# Altium schematic sheet MULTIPLIER.SchDoc
size Tabloid; SheetNumber: 7; SheetTotal: 9
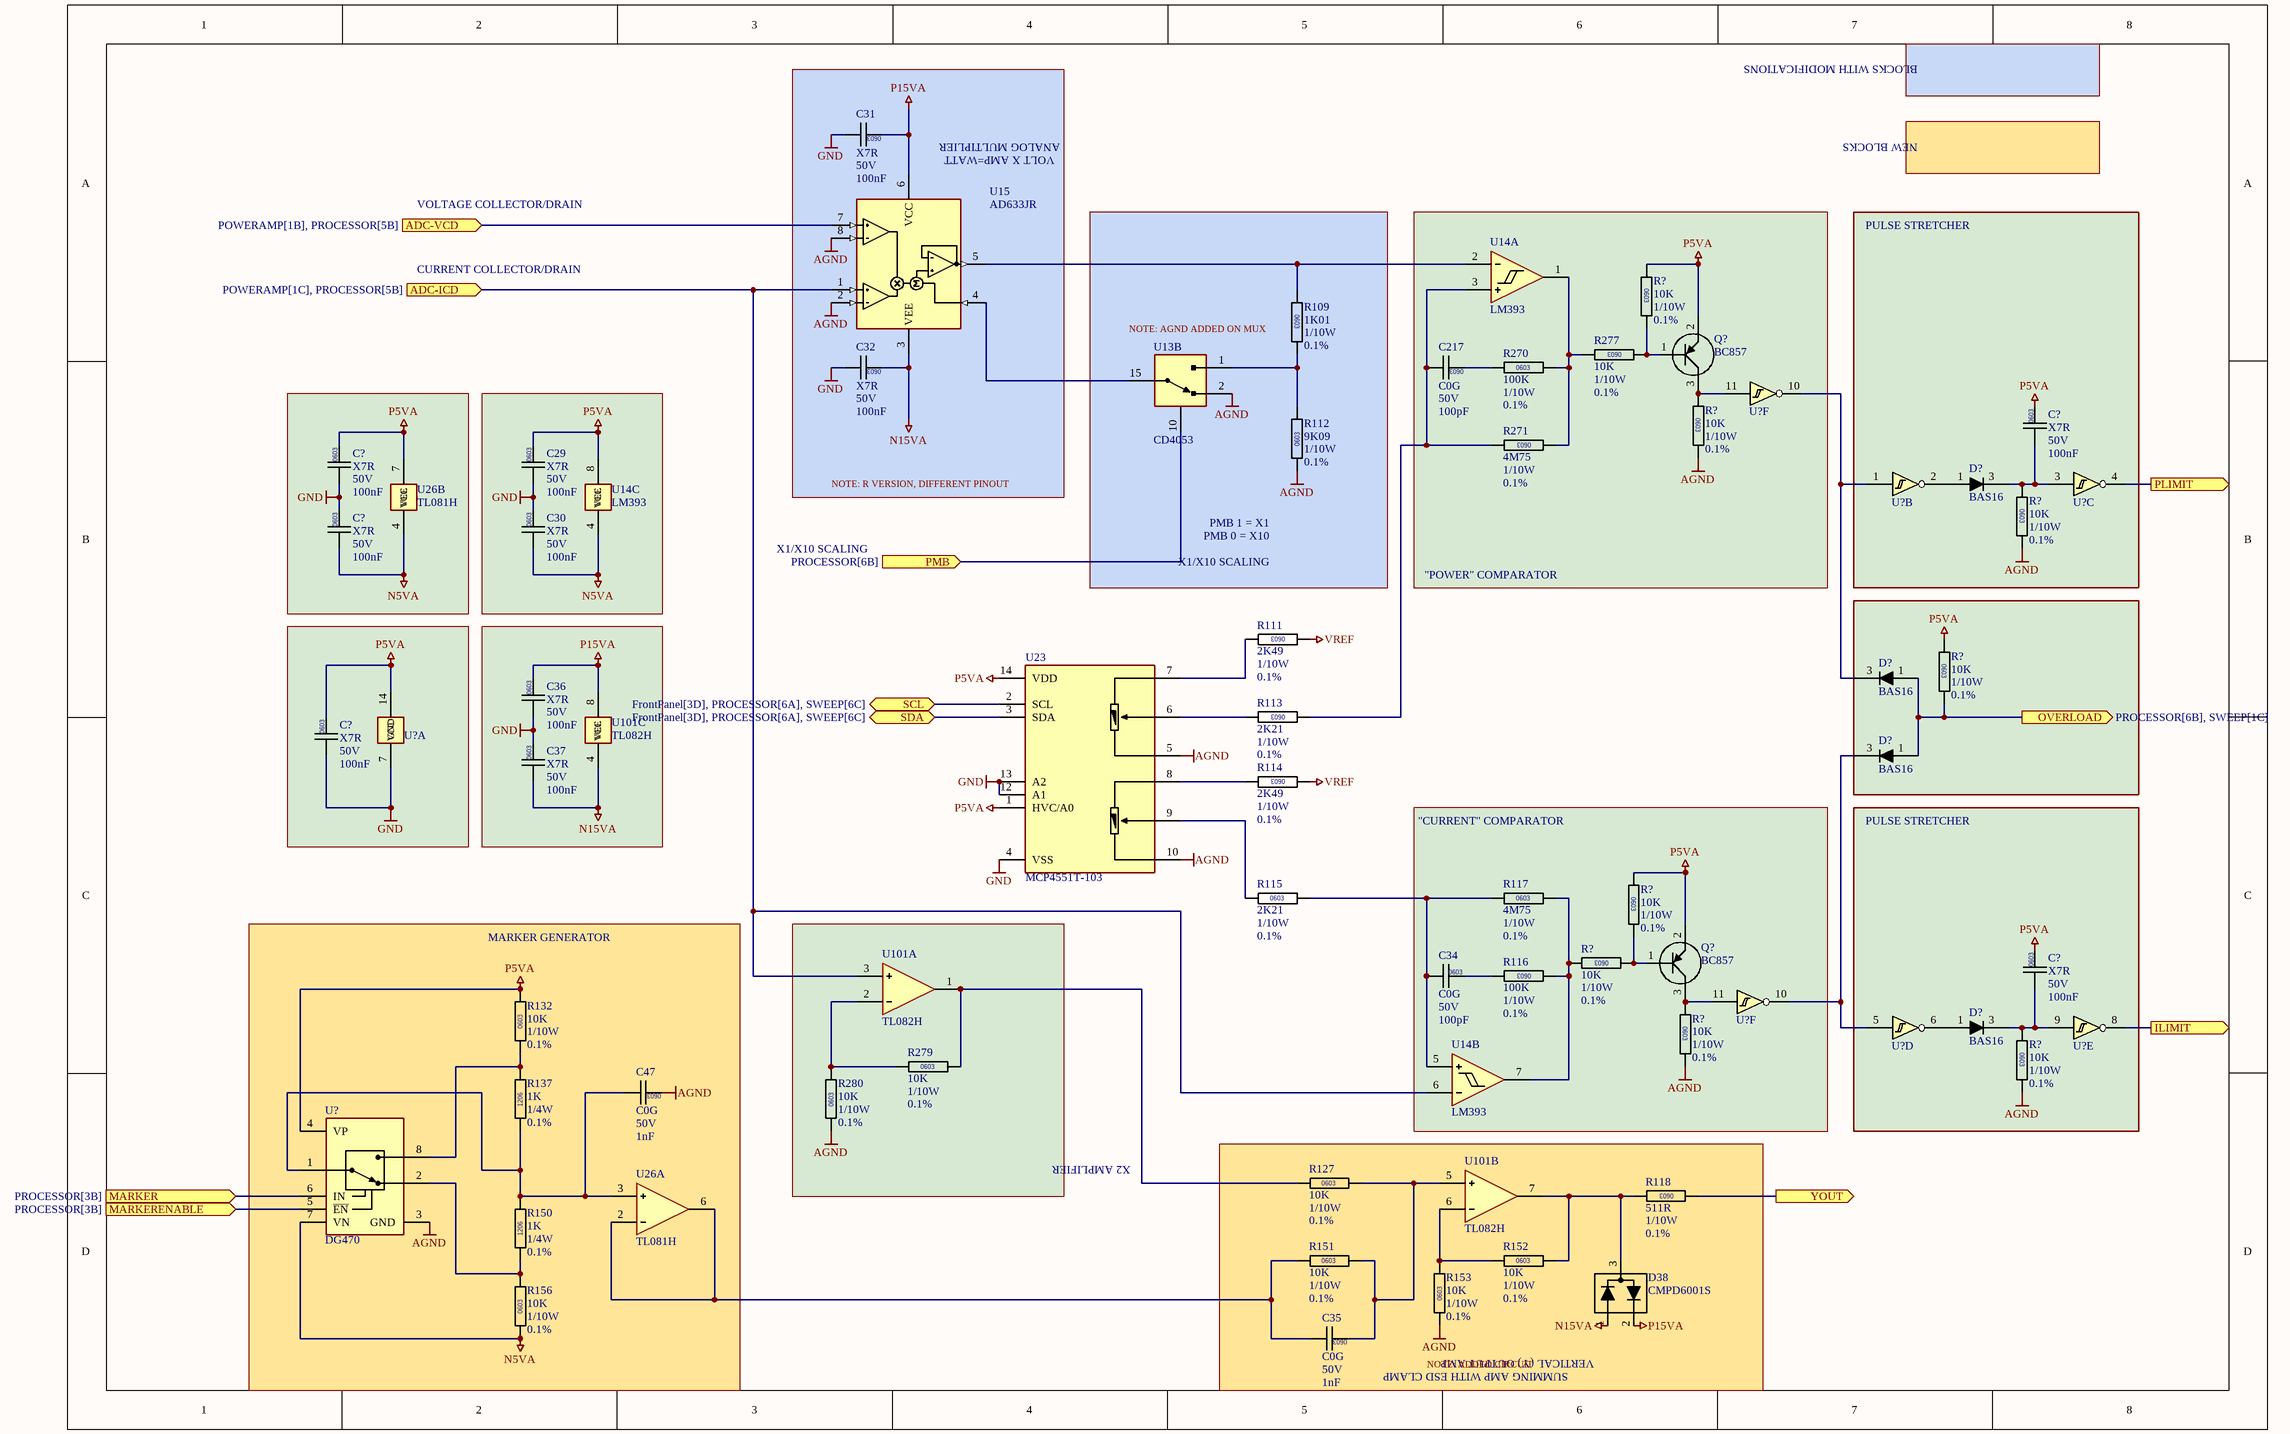
[diagram p0: MULTIPLIER.SchDoc]

## Parts
(Parts that share a designator on the sheet are numbered #1, #2 ... from top to bottom, then left to right.)
C29  Dielectric: X7R  Voltage: 50V  Capacitance: 100nF  [CAPC0603]  (hidden comment: CAP0603)
C30  Dielectric: X7R  Voltage: 50V  Capacitance: 100nF  [CAPC0603]  (hidden comment: CAP0603)
C31  Dielectric: X7R  Voltage: 50V  Capacitance: 100nF  [CAPC0603]  (hidden comment: CAP0603)
C32  Dielectric: X7R  Voltage: 50V  Capacitance: 100nF  [CAPC0603]  (hidden comment: CAP0603)
C34  Dielectric: C0G  Voltage: 50V  Capacitance: 100pF  [CAPC0603]  (hidden comment: CAP0603)
C35  Dielectric: C0G  Voltage: 50V  Capacitance: 1nF  [CAPC0603]  (hidden comment: CAP0603)
C36  Dielectric: X7R  Voltage: 50V  Capacitance: 100nF  [CAPC0603]  (hidden comment: CAP0603)
C37  Dielectric: X7R  Voltage: 50V  Capacitance: 100nF  [CAPC0603]  (hidden comment: CAP0603)
C47  Dielectric: C0G  Voltage: 50V  Capacitance: 1nF  [CAPC0603]  (hidden comment: CAP0603)
C217  Dielectric: C0G  Voltage: 50V  Capacitance: 100pF  [CAPC0603]  (hidden comment: CAP0603)
C?#1  Dielectric: X7R  Voltage: 50V  Capacitance: 100nF  [CAPC0603]  (hidden comment: CAP0603)
C?#2  Dielectric: X7R  Voltage: 50V  Capacitance: 100nF  [CAPC0603]  (hidden comment: CAP0603)
C?#3  Dielectric: X7R  Voltage: 50V  Capacitance: 100nF  [CAPC0603]  (hidden comment: CAP0603)
C?#4  Dielectric: X7R  Voltage: 50V  Capacitance: 100nF  [CAPC0603]  (hidden comment: CAP0603)
C?#5  Dielectric: X7R  Voltage: 50V  Capacitance: 100nF  [CAPC0603]  (hidden comment: CAP0603)
D38  CMPD6001S  [SOT23]
D?#1  BAS16  [SOT23]
D?#2  BAS16  [SOT23]
D?#3  BAS16  [SOT23]
D?#4  BAS16  [SOT23]
Q?#1  BC857  [SOT23]
Q?#2  BC857  [SOT23]
R109  value 1K01  Power: 1/10W  Tolerance: 0.1%  [RESC0603]  (hidden comment: RESC0603)
R111  value 2K49  Power: 1/10W  Tolerance: 0.1%  [RESC0603]  (hidden comment: RESC0603)
R112  value 9K09  Power: 1/10W  Tolerance: 0.1%  [RESC0603]  (hidden comment: RESC0603)
R113  value 2K21  Power: 1/10W  Tolerance: 0.1%  [RESC0603]  (hidden comment: RESC0603)
R114  value 2K49  Power: 1/10W  Tolerance: 0.1%  [RESC0603]  (hidden comment: RESC0603)
R115  value 2K21  Power: 1/10W  Tolerance: 0.1%  [RESC0603]  (hidden comment: RESC0603)
R116  value 100K  Power: 1/10W  Tolerance: 0.1%  [RESC0603]  (hidden comment: RESC0603)
R117  value 4M75  Power: 1/10W  Tolerance: 0.1%  [RESC0603]  (hidden comment: RESC0603)
R118  value 511R  Power: 1/10W  Tolerance: 0.1%  [RESC0603]  (hidden comment: RESC0603)
R127  value 10K  Power: 1/10W  Tolerance: 0.1%  [RESC0603]  (hidden comment: RESC0603)
R132  value 10K  Power: 1/10W  Tolerance: 0.1%  [RESC0603]  (hidden comment: RESC0603)
R137  value 1K  Power: 1/4W  Tolerance: 0.1%  [RESC1206]  (hidden comment: RESC1206)
R150  value 1K  Power: 1/4W  Tolerance: 0.1%  [RESC1206]  (hidden comment: RESC1206)
R151  value 10K  Power: 1/10W  Tolerance: 0.1%  [RESC0603]  (hidden comment: RESC0603)
R152  value 10K  Power: 1/10W  Tolerance: 0.1%  [RESC0603]  (hidden comment: RESC0603)
R153  value 10K  Power: 1/10W  Tolerance: 0.1%  [RESC0603]  (hidden comment: RESC0603)
R156  value 10K  Power: 1/10W  Tolerance: 0.1%  [RESC0603]  (hidden comment: RESC0603)
R270  value 100K  Power: 1/10W  Tolerance: 0.1%  [RESC0603]  (hidden comment: RESC0603)
R271  value 4M75  Power: 1/10W  Tolerance: 0.1%  [RESC0603]  (hidden comment: RESC0603)
R277  value 10K  Power: 1/10W  Tolerance: 0.1%  [RESC0603]  (hidden comment: RESC0603)
R279  value 10K  Power: 1/10W  Tolerance: 0.1%  [RESC0603]  (hidden comment: RESC0603)
R280  value 10K  Power: 1/10W  Tolerance: 0.1%  [RESC0603]  (hidden comment: RESC0603)
R?#1  value 10K  Power: 1/10W  Tolerance: 0.1%  [RESC0603]  (hidden comment: RESC0603)
R?#2  value 10K  Power: 1/10W  Tolerance: 0.1%  [RESC0603]  (hidden comment: RESC0603)
R?#3  value 10K  Power: 1/10W  Tolerance: 0.1%  [RESC0603]  (hidden comment: RESC0603)
R?#4  value 10K  Power: 1/10W  Tolerance: 0.1%  [RESC0603]  (hidden comment: RESC0603)
R?#5  value 10K  Power: 1/10W  Tolerance: 0.1%  [RESC0603]  (hidden comment: RESC0603)
R?#6  value 10K  Power: 1/10W  Tolerance: 0.1%  [RESC0603]  (hidden comment: RESC0603)
R?#7  value 10K  Power: 1/10W  Tolerance: 0.1%  [RESC0603]  (hidden comment: RESC0603)
R?#8  value 10K  Power: 1/10W  Tolerance: 0.1%  [RESC0603]  (hidden comment: RESC0603)
U13  CD4053  [SO127P600-16N]  (part B of 4)
U14  LM393  [SO127P600-8N]  (parts A,B,C of 3)
U15  AD633JR  [SO127P600-8N]
U23  MCP4551T-103
U26  TL081H  [SO127P600-8N]  (parts A,B of 2)
U101  TL082H  [SO127P600-8N]  (parts A,B,C of 3)
U?#1  CD40106  (value not drawn)  (part F of 7)
U?#2  CD40106  (value not drawn)  (part B of 7)
U?#3  CD40106  (value not drawn)  (part C of 7)
U?#4  CD40106  (value not drawn)  (part A of 7)
U?#5  CD40106  (value not drawn)  (part F of 7)
U?#6  CD40106  (value not drawn)  (part D of 7)
U?#7  CD40106  (value not drawn)  (part E of 7)
U?#8  DG470  [SO127P600-8N]

## Blocks framed on the sheet
"POWER" COMPARATOR: C217 Q?#1 R270 R271 R277 R?#1 R?#2 U14 U?#1
PULSE STRETCHER: C?#1 D?#1 R?#3 U?#2 U?#3
"CURRENT" COMPARATOR: C34 Q?#2 R116 R117 R?#5-R?#7 U14 U?#5
PULSE STRETCHER: C?#5 D?#4 R?#8 U?#6 U?#7
MARKER GENERATOR: C47 R132 R137 R150 R156 U26 U?#8
X2 AMPLIFIER: R279 R280 U101

## Ports
ADC-ICD (in, see POWERAMP[1C], PROCESSOR[5B]), ADC-VCD (in, see POWERAMP[1B], PROCESSOR[5B]), ILIMIT (out), MARKER (in, see PROCESSOR[3B]), MARKERENABLE (in, see PROCESSOR[3B]), OVERLOAD (out, see PROCESSOR[6B], SWEEP[1C]), PLIMIT (out), PMB (in, see PROCESSOR[6B]), SCL (bidir, see FrontPanel[3D], PROCESSOR[6A], SWEEP[6C]), SDA (bidir, see FrontPanel[3D], PROCESSOR[6A], SWEEP[6C]), YOUT (out)

## Nets
AGND: C47.1 R112.2 R153.2 R280.2 R?#2.1 R?#3.1 R?#7.1 R?#8.1 U13.2(Y2) U15.2(YN) U15.8(X1N) U23.5(POA) U23.10(POB) U?#8.3(GND)
GND: C29.2 C30.1 C31.2 C32.2 C36.2 C37.1 C?#2.2 C?#3.1 C?#4.2 U23.4(VSS) U23.12(A1) U23.13(A2) U?#4.7(GND)
N5VA: C30.2 C?#3.2 R156.2 U14.4(VEE) U26.4(VEE) U?#8.7(VN)
N15VA: C32.1 C37.2 D38.1(K) U15.3(VEE) U101.4(VEE)
P5VA: C29.1 C?#1.1 C?#2.1 C?#4.1 C?#5.1 Q?#1.2(E) Q?#2.2(E) R132.1 R?#1.2 R?#4.2 R?#5.2 U14.8(VCC) U23.1(HVC/A0) U23.14(VDD) U26.7(VCC) U?#4.14(VCC) U?#8.4(VP)
P15VA: C31.1 C36.1 D38.2(A) U15.6(VCC) U101.8(VCC)
VREF: R111.2 R114.2
ADC-ICD: U14.6(-) U15.1(YP) U101.3(+) ; port ADC-ICD
ADC-VCD: U15.7(X1P) ; port ADC-VCD
ILIMIT: U?#7.8 ; port ILIMIT
MARKER: U?#8.6(IN) ; port MARKER
MARKERENABLE: U?#8.5(~{EN}) ; port MARKERENABLE
OVERLOAD: D?#2.1(A) D?#3.1(A) R?#4.1 ; port OVERLOAD
PLIMIT: U?#3.4 ; port PLIMIT
PMB: U13.10(A) ; port PMB
SCL: U23.2(SCL) ; port SCL
SDA: U23.3(SDA) ; port SDA
YOUT: R118.2 ; port YOUT
NetC34_1: C34.1 R116.2
NetC34_2: C34.2 R115.1 R117.2 U14.5(+)
NetC35_1: C35.1 R127.1 R151.1 U101.5(+)
NetC35_2: C35.2 R151.2 U26.2(-) U26.6(O)
NetC47_2: C47.2 R137.2 R150.1 U26.3(+) U?#8.1(COM)
NetC217_1: C217.1 R270.2
NetC217_2: C217.2 R113.2 R271.2 U14.3(+)
NetC?#1_2: C?#1.2 D?#1.3(K) R?#3.2 U?#3.3
NetC?#5_2: C?#5.2 D?#4.3(K) R?#8.2 U?#7.9
NetD38_3: D38.3(A) R118.1 R152.1 U101.7(O)
NetD?#1_1: D?#1.1(A) U?#2.2
NetD?#2_3: D?#2.3(K) U?#1.10 U?#2.1
NetD?#3_3: D?#3.3(K) U?#5.10 U?#6.5
NetD?#4_1: D?#4.1(A) U?#6.6
NetQ?#1_1: Q?#1.1(B) R277.2 R?#1.1
NetQ?#1_3: Q?#1.3(C) R?#2.2 U?#1.11
NetQ?#2_1: Q?#2.1(B) R?#5.1 R?#6.2
NetQ?#2_3: Q?#2.3(C) R?#7.2 U?#5.11
NetR109_1: R109.1 R112.1 U13.1(Y0)
NetR109_2: R109.2 U14.2(-) U15.5(W)
NetR111_1: R111.1 U23.7(POB)
NetR113_1: R113.1 U23.6(OW)
NetR114_1: R114.1 U23.8(POA)
NetR115_2: R115.2 U23.9(OW)
NetR116_1: R116.1 R117.1 R?#6.1 U14.7(O)
NetR127_2: R127.2 R279.1 U101.1(O)
NetR132_2: R132.2 R137.1 U?#8.8(NO)
NetR150_2: R150.2 R156.1 U?#8.2(COM)
NetR152_2: R152.2 R153.1 U101.6(-)
NetR270_1: R270.1 R271.1 R277.1 U14.1(O)
NetR279_2: R279.2 R280.1 U101.2(-)
NetU13_15: U13.15(X2) U15.4(Z)

## Notes on the sheet
- BLOCKS WITH MODIFICATIONS
- (near U15) ANALOG MULTIPLIER
- (near U15) VOLT X AMP=WATT
- NEW BLOCKS
- VOLTAGE COLLECTOR/DRAIN
- CURRENT COLLECTOR/DRAIN
- (near U13) NOTE: AGND ADDED ON MUX
- NOTE: R VERSION, DIFFERENT PINOUT
- X1/X10 SCALING
- PMB 0 = X10
- PMB 1 = X1
- (near R153) NOTE: ADDED CIRCUIT
- SUMMING AMP WITH ESD CLAMP
- (near D38) VERTICAL (Y) OUTPUT AMP
- (in symbol RESC-0603-1K01-0.1%-1/10W) 0603
- (in symbol RESC-0603-2K21-0.1%-1/10W) 0603
- (in symbol RESC-0603-2K49-0.1%-1/10W) 0603
- (in symbol RESC-0603-4M75-1%-1/10W) 0603
- (in symbol RESC-0603-9K09-0.1%-1/10W) 0603
- (in symbol RESC-0603-10K-0.1%-1/10W) 0603
- (in symbol RESC-0603-100K-0.1%-1/10W) 0603
- (in symbol RESC-0603-511R-0.1%) 0603
- (in symbol RESC-1206-1K-0.1%-1/4W) 1206

## Library data of the parts
C29-C32 C36 C37 C?#1-C?#5 = CAPC-0603-100nF-50V-X7R: CAPACITOR,CERAMIC,100nF,50V,X7R,0603; Manufacturer 1: KEMET; Manufacturer Part Number 1: C0603C104K5RACTU; Package / Case: 0603; Location: *; Supplier 1: Mouser; Supplier Part Number 1: 80-C0603C104K5R7867; Supplier 2: Mouser; Supplier Part Number 2: 80-C0603C104K5R7411; Supplier 3: Avnet; Supplier Part Number 3: KGM15BR71H104KT; Supplier 4: Digikey; Supplier Part Number 4: 1276-1000-1-ND; LCSC: C127833; MOUSER: 80-C0603C104K5R
C34 C217 = CAPC-0603-100pF-50V-C0G: CAPACITOR,CERAMIC,100pF,50V,C0G,0603; Package / Case: 0603; Location: *
C35 C47 = CAPC-0603-1nF-20V-C0G: CAPACITOR,CERAMIC,1nF,50V,C0G,0603; Package / Case: 0603; Location: *
D38 = DIODE-CENTRALSEMI-CMPD6001S: DIODE,75V,250mA,SOT23,500pA ULTRA LOW LEAKAGE; Manufacturer 1: CENTRAL SEMICONDUCTOR; Manufacturer Part Number 1: CMPD6001S
D?#1-D?#4 = DIODE-RECTIFIER-DIODES-BAS16-SOT23: DIODE,RECTIFIER,75V,0.3A,BAS16,SOT23; Manufacturer 1: ONSEMI; Manufacturer Part Number 1: BAS16LT1G; DIGIKEY: BAS16LT1GOSCT-ND
Q?#1 Q?#2 = XSTR-PNP-BC857: XSTR,PNP,SOT23,BC857,SOT23; Manufacturer 1: NEXPERIA; Manufacturer Part Number 1: BC857BW,115; DIGIKEY: 1727-4869-1-ND
R109 = RESC-0603-1K01-0.1%-1/10W: RESISTOR,1K01,0.1%,100mW,0603 (1608); Location: *
R111 R114 = RESC-0603-2K49-0.1%-1/10W: RESISTOR,2K49,0.1%,100mW,0603 (1608); Location: *
R112 = RESC-0603-9K09-0.1%-1/10W: RESISTOR,9K09,0.1%,100mW,0603 (1608); Location: *
R113 R115 = RESC-0603-2K21-0.1%-1/10W: RESISTOR,2K21,0.1%,100mW,0603 (1608); Location: *
R116 R270 = RESC-0603-100K-0.1%-1/10W: RESISTOR,100K,0.1%,100mW,0603 (1608); Location: *
R117 R271 = RESC-0603-4M75-1%-1/10W: RESISTOR,4M75,0.1%,100mW,0603 (1608); Location: *
R118 = RESC-0603-511R-0.1%: RESISTOR,511R,0.1%,100mW,0603 (1608); Location: *
R127 R132 R151-R153 R156 R277 R279 R280 R?#1-R?#8 = RESC-0603-10K-0.1%-1/10W: RESISTOR,10K,0.1%,100mW,0603 (1608); Location: *
R137 R150 = RESC-1206-1K-0.1%-1/4W: RESISTOR,1K,1206,0.1%,125mW,1206; Location: *; Parameter 4: *
U13 = IC-TI-CD4053-SPLIT: IC,LOGIC,CMOS,4XXX,TRIPLE 2:1 MUX,SPLIT BLOCKS
U14 = IC-TI-LM393-SO8: IC,COMPARATOR,DUAL,LM393,SO8; Manufacturer 1: DIODES-INC; Manufacturer Part Number 1: AS393AMTR-E1; DIGIKEY: AS393AMTR-E1
U15 = IC-ANALOG-AD633XR-SO8: IC,ANALOG,MULTIPLIER,ANALOGDEVICES,AD633JRZ,SO8; DIGIKEY: 505-AD633JRZ-ND; Manufacturer 1: ANALOG DEVICES; Manufacturer Part Number 1: AD633JRZ
U23 = IC-MICROCHIP-MCP4651T-103: IC,DIGITAL POTMETER,257STEP,I2C,10K,MICROCHIP,MCP4551T-103
U26 = IC-TI-TL081-SO8: IC,OPAMP JFET,SINGLE,TL081HIDR,SO8; Manufacturer 1: TI; Manufacturer Part Number 1: TL081HIDR; MOUSER: 595-TL081HIDR
U101 = IC-TI-TL082H-SO8: IC,OPAMP JFET,DUAL,TL082HIDR,SO8; Manufacturer 1: TI; Manufacturer Part Number 1: TL082HIDR; MOUSER: 595-TL082HIDR
U?#1-U?#7 = IC-TI-CD40106-SO14: IC,LOGIC,CMOS.4XXX,HEX SCHMITTTRIGGER,CD40106,SO14; Manufacturer 1: ONSEMI; Manufacturer Part Number 1: MC74AC14DR2G; DIGIKEY: MC74AC14DR2GOSCT-ND
U?#8 = IC-SILICONIX-DG470EY-T1-E3-SO8: IC,ANALOG,SPDT ANALOG SWITCH,SILICONIX,DG470EY-T1-E3,SO8; Manufacturer 1: VSHIAY; DIGIKEY: DG470EY-T1-E3CT-ND; Manufacturer Part Number 1: DG470EY-T1-E3